# Altium schematic sheet Regulador_5v_FF21.SchDoc
size A4; SheetNumber: 1; SheetTotal: 1
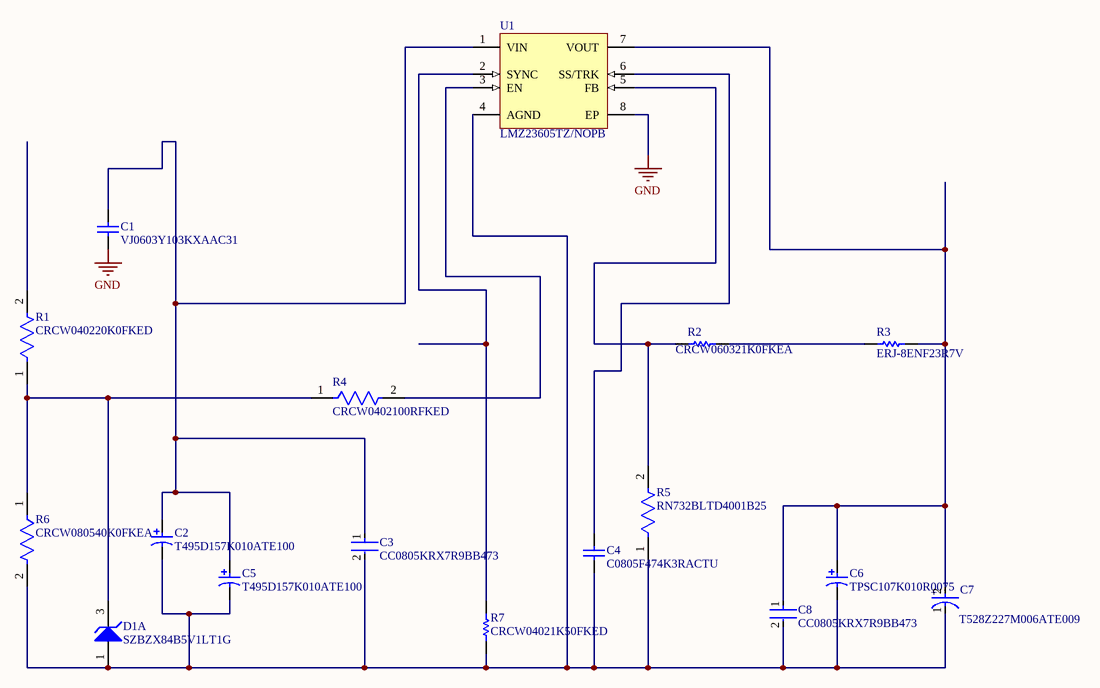
[diagram p0: Regulador_5v_FF21.SchDoc]

## Parts
C1  VJ0603Y103KXAAC31  [CAPC1608X97X38LL15T08]
C2  T495D157K010ATE100  [KEMT-T495-D_L]
C3  CC0805KRX7R9BB473  [FP-CC0805-0_85-MFG]
C4  C0805F474K3RACTU  [CAPC2013X140X50ML20T25]
C5  T495D157K010ATE100  [KEMT-T495-D_L]
C6  TPSC107K010R0075  [AVX-C2312_L]
C7  T528Z227M006ATE009  [FP-T528Z227M006ATE009-MFG]
C8  CC0805KRX7R9BB473  [FP-CC0805-0_85-MFG]
D1  SZBZX84B5V1LT1G  [ONSC-SOT-23-3-318-08_V]  (part A of 2)
R1  CRCW040220K0FKED  [FP-CRCW0402-e3-IPC_B]
R2  CRCW060321K0FKEA  [RESC1609X50X30LL10T20]
R3  ERJ-8ENF23R7V  [RESC3216X70X50NL05T20]
R4  CRCW0402100RFKED  [FP-CRCW0402-e3-IPC_C]
R5  RN732BLTD4001B25  [FP-RN732B-MFG]
R6  CRCW080540K0FKEA  [FP-CRCW0805-e3-MFG]
R7  CRCW04021K50FKED  [RESC1005X40X25NL05T05]
U1  LMZ23605TZ/NOPB  [NDW0007A_V]

## Nets
GND: C1.1 U1.8(EP)
NetC1_2: C1.2 C2.1 C3.1 C5.1 U1.1(VIN)
NetC2_2: C2.2 C3.2 C4.1 C5.2 C6.2 C7.1(C) C8.2 D1.1(A) R5.1 R6.2 R7.1 U1.4(AGND)
NetC4_2: C4.2 U1.6(SS/TRK)
NetC6_1: C6.1 C7.2(A) C8.1 R3.2 U1.7(VOUT)
NetD1_3: D1.3(K) R1.1 R4.1 R6.1
NetR2_1: R2.1 R5.2 U1.5(FB)
NetR2_2: R2.2 R3.1
NetR4_2: R4.2 U1.3(EN)
NetR7_2: R7.2 U1.2(SYNC)

Not connected (* = marked no-connect by the designer): R1 2

## Notes on the sheet
- (in symbol CMP-03017-000006-1) +

## Library data of the parts
C1 = CMP-2006-00011-1: Manufacturer: Vitramon; Part Number: VJ0603Y103KXAAC31
C2 C5 = CMP-2000-07208-1: Capacitor, Tantalum, 150 uF, +/- 10%, 10 V, -55 to 125 degC, 2-Pin SMD, RoHS, Tape and Reel; Manufacturer: Kemet; Capacitance: 150µF; ESR: 0.1ohm; Voltage Rating: 10V; Capacitor Case Style: 2917; Package Description: 2-Pin Surface Mount Device, Body 7.3 x 4.3 mm; MSL: MSL1-Unlimited; Package Reference: T495-D; Mounting Technology: SurfaceMount; Datasheet URL: http://capacitoredge.kemet.com/capedge2/DataSheet/Datasheet-T495D157K010ATE100.pdf?pn=T495D157K010ATE100; Datasheet Version: 09/2016; Capacitance Tolerance: ±10%; Capacitor Terminals: SMD; Operating Temperature Range: -55°Cto+125°C; Manufacturer URL: http://www.kemet.com/
C3 C8 = CMP-03422-000052-1: CAP CER 0.047UF 50V X7R 0805; Manufacturer: Yageo; Value: 47 nF; Tolerance: 0.1; Material: Ceramic; Footprint Url: http://www.yageo.com/exep/pages/download/literatures/UPY-C_GEN_24.pdf; ComponentLink2URL: http://www.yageo.com/documents/recent/UPY-GPHC_Y5V_6.3V-to-50V_8.pdf; Ipc Land Pattern Name: CAPC200125X85; Manufacturer Part Number: CC0805KRX7R9BB473; Digikey Description: CAP CER 0.047UF 50V X7R 0805; Lead Free: Yes; Octopart: https://octopart.com/cc0805krx7r9bb473-yageo-42181304; Voltage Rating: 50 V; RoHS: TRUE; ComponentLink2Description: Datasheet; Temperature Range High: +85°C; Package: CC0805-0.85; Temperature Range Low: -30°C; Device Class L2: Capacitors; Device Class L3: Ceramic Capacitors; Height: 0.95mm; Temperature: -30°C to +85°C; Category: Cap; Device Class L1: Passive Components; Capacitance: 47 nF; Temperature Characteristic: X7R; Automotive: No; Mouser Description: Multilayer Ceramic Capacitors MLCC - SMD/SMT 47nF 50V X7R 10%
C4 = CMP-2007-03309-1: Manufacturer: Kemet; Part Number: C0805F474K3RACTU
C6 = CMP-2000-07293-1: TPS Series, Low ESR, 100 uF, +/- 10%, 10 V, -55 to 125 degC, 2-Pin SMD (2312), RoHS, Tape and Reel; Manufacturer: AVX; Product Depth (mm): 3.2mm; DCL: 10uA; Product Length (mm): 6mm; ESR: 0.075ohm; Product Height (mm): 2.6mm; Insulation: NotRequired; Voltage: 10VDC; Product Diameter (mm): NotRequiredmm; Case Style: Molded; Capacitance: 100000000pF; Rad Hardened: No; DF: 8%; Polarity: Polar; DELETED: Compliant; Manufacturer URL: http://www.avx.com/; Package Reference: C2312; Tolerance (+ or -): 10%; Datasheet Version: 01/2016; Package / Case: 6032-28; Construction: SMTChip; Failure Rate: NotRequired; Package Description: 2-Pin Surface Mount Device, Body 6 x 3.25 mm; Operating Temp Range: -55Cto125C; Packaging: TapeandReel; Seated Plane Height: NotRequiredmm; Case Code: C; Package URL: http://download.siliconexpert.com/pdfs/2016/2/7/1/56/13/306/avx_/manual/6tps.pdf; Length W/Weld (max): NotRequiredmm; Wire Form: NotRequired; Lead Spacing (nom): NotRequiredmm; Mounting Technology: SurfaceMount; Mounting Style: SurfaceMount; Datasheet URL: http://download.siliconexpert.com/pdfs/2016/2/7/1/56/13/306/avx_/manual/6tps.pdf; Length W/Weld: NotRequiredmm; Seal: NotRequired
C7 = CMP-03017-000006-1: CAP TANT POLY 220UF 6.3V 2917; Tolerance: 20%; Dissipation Factor: 10%; ESR (Equivalent Series Resistance): 9mR; Ripple Current: 6A; Leakage Current: 138.6uA; Polarity: Polar; Mount: Surface Mount; Termination: SMD/SMT; Features: General Purpose; Case Code (Imperial): 2917; Min Operating Temperature: -55°C; Height - Seated (Max): 0.067inch; Depth: 4.3mm; Package Quantity: 1; Voltage Rating (DC): 6.3V; Max Operating Temperature: 105°C; Capacitance: 220uF; Packaging: Tape and Reel; Voltage Rating: 6.3V; Case/Package: 2917; Construction: Flat; REACH SVHC: No SVHC; Width: 4.3mm; RoHS Compliant: Yes; Height: 1.7mm; Case Code (Metric): 7343; Length: 7.3mm; Series: KO-CAP T528
D1 = CMP-1060-00895-1: Zener Voltage Regulator, 225 mW, 3-Pin SOT-23, Pb-Free, Tape and Reel; Manufacturer: On Semiconductor; VZ Typ (V): 5.1; ComponentLink3URL: http://www.onsemi.cn/pub_link/Collateral/318-08.PDF; ComponentLink2Description: Datasheet; PackageVersion: Rev. AP, 11/2009; ComponentLink3Description: Package Specification; PartNumber: SZBZX84B5V1LT1G; DatasheetVersion: Rev. 17; RoHS: Pb-Free; Mounting Technology: Surface Mount; ComponentLink2URL: http://www.onsemi.com/pub_link/Collateral/BZX84C2V4LT1-D.PDF; PackageDescription: 3-Pin Small Outline Transistor, Body 2.92 x 1.3 mm, Pitch 0.95 mm; ComponentLink1Description: Manufacturer URL; PackageReference: SOT-23-3-318-08; ComponentLink1URL: http://www.onsemi.com/; Packing: Tape and Reel
R1 = CMP-2002-08356-2: RES Thick Film, 20kΩ, 1%, 0.063W, 100ppm/°C, 0402; Max Power Dissipation: 63mW; Working Voltage: 50V; Resistance: 20kR; Contact Plating: Tin; Packaging: Tape and Reel; Height: 0.35mm; Case Code (Imperial): 0402; Tolerance: 1%; Width: 0.5mm; Composition: Thick Film; Mount: Surface Mount; Termination: SMD/SMT; Number of Pins: 2; Number of Terminations: 2; Length: 1mm; Temperature Coefficient: 100ppm/°C; Case Code (Metric): 1005; Voltage Rating: 50V; Lead Free: Lead Free; Voltage Rating (DC): 50V; Min Operating Temperature: -55°C; Max Operating Temperature: 155°C; Package Quantity: 10; Radiation Hardening: No; Weight: 2.3E-05oz; Military Standard: Not; Case/Package: 0402; Power Rating: 63mW; Depth: 0.5mm; Features: Automotive AEC-Q200
R2 = CMP-2000-03080-1: Manufacturer: Vishay Dale; Part Number: CRCW060321K0FKEA
R3 = CMP-2003-00238-1: Manufacturer: Panasonic; Part Number: ERJ-8ENF23R7V
R4 = CMP-1011-00397-3: RES Thick Film, 100Ω, 1%, 0.063W, 100ppm/°C, 0402; Max Power Dissipation: 63mW; Voltage Rating: 50V; Resistance: 100R; Package Quantity: 10; Lead Free: Lead Free; Termination: SMD/SMT; Case Code (Metric): 1005; Number of Terminations: 2; Composition: Thick Film; Voltage Rating (DC): 50V; Min Operating Temperature: -55°C; Case/Package: 0402; Radiation Hardening: No; Max Operating Temperature: 155°C; Temperature Coefficient: 100ppm/°C; Military Standard: Not; Length: 1mm; Mount: Surface Mount; Power Rating: 63mW; Weight: 2.3E-05oz; Working Voltage: 50V; Features: Automotive AEC-Q200; Depth: 0.5mm; Packaging: Tape and Reel; Tolerance: 1%; Height: 0.35mm; Case Code (Imperial): 0402; Width: 0.02inch; Contact Plating: Tin
R5 = CMP-04015-017647-1: 4kΩ ±0.1% 0.125W, 1/8W Chip Resistor 1206 (3216 Metric) Moisture Resistant Thin Film; Temperature Coefficient: 25ppm/°C; Voltage Rating: 150V; Power Rating: 125mW; Resistance: 4kR; Tolerance: 0.1%; Min Operating Temperature: -55°C; Weight: 0.000571oz; Max Operating Temperature: 125°C; Case/Package: 1206; Width: 1.6mm; Case Code (Metric): 3216; Packaging: Tape and Reel; Case Code (Imperial): 1206; Length: 3.2mm; Height: 0.6mm; Composition: Thin Film; Termination: SMD/SMT
R6 = CMP-02407-003498-1: RES Thick Film, 40kΩ, 1%, 0.125W, 100ppm/°C, 0805; Resistance: 40kR; Max Power Dissipation: 125mW; Tolerance: 1%; Features: Automotive AEC-Q200; Max Operating Temperature: 155°C; Composition: Thick Film; Length: 0.079inch; Case/Package: 0805; Min Operating Temperature: -55°C; Packaging: Tape and Reel; Number of Terminations: 2; Width: 0.049inch; Height: 0.02inch; Package Quantity: 5000; Lead Free: Lead Free; Temperature Coefficient: 100ppm/°C
R7 = CMP-2002-08297-1: Manufacturer: Vishay Dale; Part Number: CRCW04021K50FKED
U1 = CMP-0069-02058-2: 5A SIMPLE SWITCHER® Power Module with 36V Maximum Input Voltage, 7 pin TO-PMOD, 45 Rail; Manufacturer: Texas Instruments; PackageTopMarking: NSUZXYTTE#*LMZ23605; PowerWise: N; PinCount: 7; ComponentLink1URL: http://www.ti.com/general/docs/lit/getliterature.tsp?genericPartNumber=LMZ23605&fileType=pdf; PackageDescription: TO-PMOD-7, 10.16 x 9.85 x 4.57 mm Body, 7 Lead, 1.27mm Pitch, Surface Mount; CompType: Switcher; ComponentLink1Description: Datasheet URL; RoHS: Y; PackageReference: NDW0007A